# EAGLE design redox-light-left (EAGLE 9.1.3)
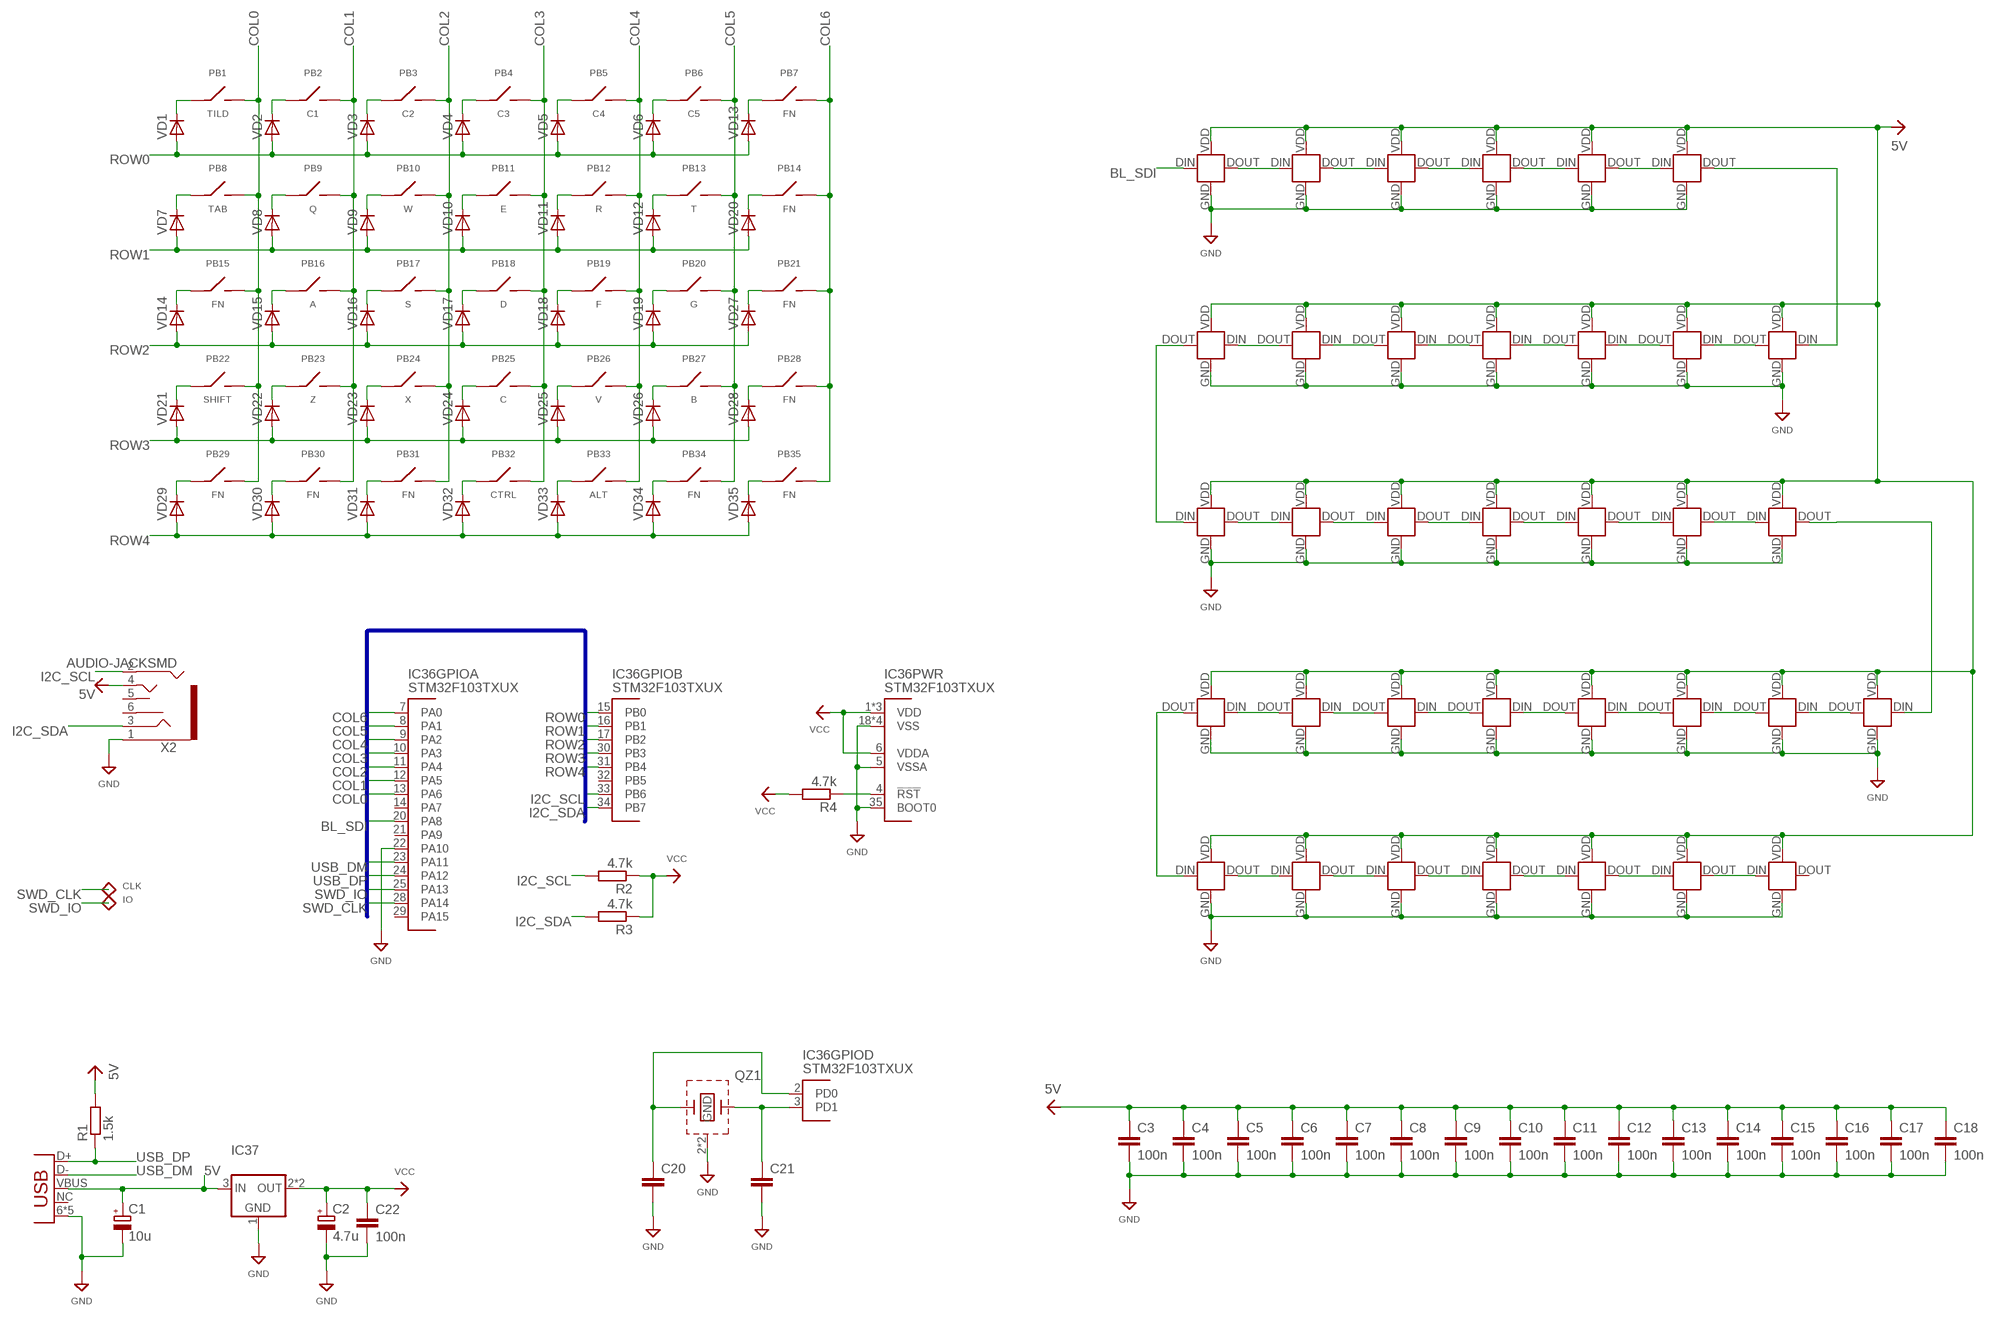
[diagram p0: schematic, sheet 1]

## Parts
C1  10u  CPOL-EUSMCA  [SMC_A]
C2  4.7u  CPOL-EUSMCA  [SMC_A]
C3  100n  CAP0402  [R0402]
C4  100n  CAP0402  [R0402]
C5  100n  CAP0402  [R0402]
C6  100n  CAP0402  [R0402]
C7  100n  CAP0402  [R0402]
C8  100n  CAP0402  [R0402]
C9  100n  CAP0402  [R0402]
C10  100n  CAP0402  [R0402]
C11  100n  CAP0402  [R0402]
C12  100n  CAP0402  [R0402]
C13  100n  CAP0402  [R0402]
C14  100n  CAP0402  [R0402]
C15  100n  CAP0402  [R0402]
C16  100n  CAP0402  [R0402]
C17  100n  CAP0402  [R0402]
C18  100n  CAP0402  [R0402]
C20  CAP0402  [R0402]
C21  CAP0402  [R0402]
C22  100n  CAP0402  [R0402]
IC1  SK68XX-MINI  [SK68XX-MINI]
IC2  SK68XX-MINI  [SK68XX-MINI]
IC3  SK68XX-MINI  [SK68XX-MINI]
IC4  SK68XX-MINI  [SK68XX-MINI]
IC5  SK68XX-MINI  [SK68XX-MINI]
IC6  SK68XX-MINI  [SK68XX-MINI]
IC7  SK68XX-MINI  [SK68XX-MINI]
IC8  SK68XX-MINI  [SK68XX-MINI]
IC9  SK68XX-MINI  [SK68XX-MINI]
IC10  SK68XX-MINI  [SK68XX-MINI]
IC11  SK68XX-MINI  [SK68XX-MINI]
IC12  SK68XX-MINI  [SK68XX-MINI]
IC13  SK68XX-MINI  [SK68XX-MINI]
IC14  SK68XX-MINI  [SK68XX-MINI]
IC15  SK68XX-MINI  [SK68XX-MINI]
IC16  SK68XX-MINI  [SK68XX-MINI]
IC17  SK68XX-MINI  [SK68XX-MINI]
IC18  SK68XX-MINI  [SK68XX-MINI]
IC19  SK68XX-MINI  [SK68XX-MINI]
IC20  SK68XX-MINI  [SK68XX-MINI]
IC21  SK68XX-MINI  [SK68XX-MINI]
IC22  SK68XX-MINI  [SK68XX-MINI]
IC23  SK68XX-MINI  [SK68XX-MINI]
IC24  SK68XX-MINI  [SK68XX-MINI]
IC25  SK68XX-MINI  [SK68XX-MINI]
IC26  SK68XX-MINI  [SK68XX-MINI]
IC27  SK68XX-MINI  [SK68XX-MINI]
IC28  SK68XX-MINI  [SK68XX-MINI]
IC29  SK68XX-MINI  [SK68XX-MINI]
IC30  SK68XX-MINI  [SK68XX-MINI]
IC31  SK68XX-MINI  [SK68XX-MINI]
IC32  SK68XX-MINI  [SK68XX-MINI]
IC33  SK68XX-MINI  [SK68XX-MINI]
IC34  SK68XX-MINI  [SK68XX-MINI]
IC35  SK68XX-MINI  [SK68XX-MINI]
IC36  STM32F103TXUX  [QFN-36]
IC37  LM1117  [SOT89]
PB1  TILD  CHERRY-MX-KAILH  [CHERRY-MX-KAILH]
PB2  C1  CHERRY-MX-KAILH  [CHERRY-MX-KAILH]
PB3  C2  CHERRY-MX-KAILH  [CHERRY-MX-KAILH]
PB4  C3  CHERRY-MX-KAILH  [CHERRY-MX-KAILH]
PB5  C4  CHERRY-MX-KAILH  [CHERRY-MX-KAILH]
PB6  C5  CHERRY-MX-KAILH  [CHERRY-MX-KAILH]
PB7  FN  CHERRY-MX-KAILH  [CHERRY-MX-KAILH]
PB8  TAB  CHERRY-MX-KAILH  [CHERRY-MX-KAILH]
PB9  Q  CHERRY-MX-KAILH  [CHERRY-MX-KAILH]
PB10  W  CHERRY-MX-KAILH  [CHERRY-MX-KAILH]
PB11  E  CHERRY-MX-KAILH  [CHERRY-MX-KAILH]
PB12  R  CHERRY-MX-KAILH  [CHERRY-MX-KAILH]
PB13  T  CHERRY-MX-KAILH  [CHERRY-MX-KAILH]
PB14  FN  CHERRY-MX-KAILH  [CHERRY-MX-KAILH]
PB15  FN  CHERRY-MX-KAILH  [CHERRY-MX-KAILH]
PB16  A  CHERRY-MX-KAILH  [CHERRY-MX-KAILH]
PB17  S  CHERRY-MX-KAILH  [CHERRY-MX-KAILH]
PB18  D  CHERRY-MX-KAILH  [CHERRY-MX-KAILH]
PB19  F  CHERRY-MX-KAILH  [CHERRY-MX-KAILH]
PB20  G  CHERRY-MX-KAILH  [CHERRY-MX-KAILH]
PB21  FN  CHERRY-MX-KAILH  [CHERRY-MX-KAILH]
PB22  SHIFT  CHERRY-MX-KAILH  [CHERRY-MX-KAILH]
PB23  Z  CHERRY-MX-KAILH  [CHERRY-MX-KAILH]
PB24  X  CHERRY-MX-KAILH  [CHERRY-MX-KAILH]
PB25  C  CHERRY-MX-KAILH  [CHERRY-MX-KAILH]
PB26  V  CHERRY-MX-KAILH  [CHERRY-MX-KAILH]
PB27  B  CHERRY-MX-KAILH  [CHERRY-MX-KAILH]
PB28  FN  CHERRY-MX-KAILH  [CHERRY-MX-KAILH]
PB29  FN  CHERRY-MX-KAILH  [CHERRY-MX-KAILH]
PB30  FN  CHERRY-MX-KAILH  [CHERRY-MX-KAILH]
PB31  FN  CHERRY-MX-KAILH  [CHERRY-MX-KAILH]
PB32  CTRL  CHERRY-MX-KAILH  [CHERRY-MX-KAILH]
PB33  ALT  CHERRY-MX-KAILH  [CHERRY-MX-KAILH]
PB34  FN  CHERRY-MX-KAILH  [CHERRY-MX-KAILH]
PB35  FN  CHERRY-MX-KAILH  [CHERRY-MX-KAILH]
QZ1  QUARTZ_GND3225  [3225]
R1  1.5k  RESR0402  [R0402]
R2  4.7k  RESR0402  [R0402]
R3  4.7k  RESR0402  [R0402]
R4  4.7k  RESR0402  [R0402]
TP1  CLK  TP10R  [TP10R]
TP2  IO  TP10R  [TP10R]
VD1  DIODE-SOD123  [SOD123]
VD2  DIODE-SOD123  [SOD123]
VD3  DIODE-SOD123  [SOD123]
VD4  DIODE-SOD123  [SOD123]
VD5  DIODE-SOD123  [SOD123]
VD6  DIODE-SOD123  [SOD123]
VD7  DIODE-SOD123  [SOD123]
VD8  DIODE-SOD123  [SOD123]
VD9  DIODE-SOD123  [SOD123]
VD10  DIODE-SOD123  [SOD123]
VD11  DIODE-SOD123  [SOD123]
VD12  DIODE-SOD123  [SOD123]
VD13  DIODE-SOD123  [SOD123]
VD14  DIODE-SOD123  [SOD123]
VD15  DIODE-SOD123  [SOD123]
VD16  DIODE-SOD123  [SOD123]
VD17  DIODE-SOD123  [SOD123]
VD18  DIODE-SOD123  [SOD123]
VD19  DIODE-SOD123  [SOD123]
VD20  DIODE-SOD123  [SOD123]
VD21  DIODE-SOD123  [SOD123]
VD22  DIODE-SOD123  [SOD123]
VD23  DIODE-SOD123  [SOD123]
VD24  DIODE-SOD123  [SOD123]
VD25  DIODE-SOD123  [SOD123]
VD26  DIODE-SOD123  [SOD123]
VD27  DIODE-SOD123  [SOD123]
VD28  DIODE-SOD123  [SOD123]
VD29  DIODE-SOD123  [SOD123]
VD30  DIODE-SOD123  [SOD123]
VD31  DIODE-SOD123  [SOD123]
VD32  DIODE-SOD123  [SOD123]
VD33  DIODE-SOD123  [SOD123]
VD34  DIODE-SOD123  [SOD123]
VD35  DIODE-SOD123  [SOD123]
X1  USBMICRO_B  [USB_MICROB]
X2  AUDIO-JACKSMD  [PJ-342]

## Nets
5V: C1.+ C3.1 C4.1 C5.1 C6.1 C7.1 C8.1 C9.1 C10.1 C11.1 C12.1 C13.1 C14.1 C15.1 C16.1 C17.1 C18.1 IC1.VDD(VCC) IC2.VDD(VCC) IC3.VDD(VCC) IC4.VDD(VCC) IC5.VDD(VCC) IC6.VDD(VCC) IC7.VDD(VCC) IC8.VDD(VCC) IC9.VDD(VCC) IC10.VDD(VCC) IC11.VDD(VCC) IC12.VDD(VCC) IC13.VDD(VCC) IC14.VDD(VCC) IC15.VDD(VCC) IC16.VDD(VCC) IC17.VDD(VCC) IC18.VDD(VCC) IC19.VDD(VCC) IC20.VDD(VCC) IC21.VDD(VCC) IC22.VDD(VCC) IC23.VDD(VCC) IC24.VDD(VCC) IC25.VDD(VCC) IC26.VDD(VCC) IC27.VDD(VCC) IC28.VDD(VCC) IC29.VDD(VCC) IC30.VDD(VCC) IC31.VDD(VCC) IC32.VDD(VCC) IC33.VDD(VCC) IC34.VDD(VCC) IC35.VDD(VCC) IC37.3(IN) R1.2 X1.VBUS X2.4
BL_SDI: IC1.DIN IC36.20(GPIOA:PA8)
COL0 [KEYS-MATRIX]: IC36.13(GPIOA:PA6) PB1.2 PB8.2 PB15.2 PB22.2 PB29.2
COL1 [KEYS-MATRIX]: IC36.12(GPIOA:PA5) PB2.2 PB9.2 PB16.2 PB23.2 PB30.2
COL2 [KEYS-MATRIX]: IC36.11(GPIOA:PA4) PB3.2 PB10.2 PB17.2 PB24.2 PB31.2
COL3 [KEYS-MATRIX]: IC36.10(GPIOA:PA3) PB4.2 PB11.2 PB18.2 PB25.2 PB32.2
COL4 [KEYS-MATRIX]: IC36.9(GPIOA:PA2) PB5.2 PB12.2 PB19.2 PB26.2 PB33.2
COL5 [KEYS-MATRIX]: IC36.8(GPIOA:PA1) PB6.2 PB13.2 PB20.2 PB27.2 PB34.2
COL6 [KEYS-MATRIX]: IC36.7(GPIOA:PA0) PB7.2 PB14.2 PB21.2 PB28.2 PB35.2
GND: C1.- C2.- C3.2 C4.2 C5.2 C6.2 C7.2 C8.2 C9.2 C10.2 C11.2 C12.2 C13.2 C14.2 C15.2 C16.2 C17.2 C18.2 C20.2 C21.2 C22.2 IC1.GND IC2.GND IC3.GND IC4.GND IC5.GND IC6.GND IC7.GND IC8.GND IC9.GND IC10.GND IC11.GND IC12.GND IC13.GND IC14.GND IC15.GND IC16.GND IC17.GND IC18.GND IC19.GND IC20.GND IC21.GND IC22.GND IC23.GND IC24.GND IC25.GND IC26.GND IC27.GND IC28.GND IC29.GND IC30.GND IC31.GND IC32.GND IC33.GND IC34.GND IC35.GND IC36.5(PWR:VSSA) IC36.18(PWR:VSS) IC36.22(GPIOA:PA10) IC36.26(PWR:VSS) IC36.35(PWR:BOOT0) IC36.36(PWR:VSS) IC36.PGND(PWR:VSS) IC37.1(GND) QZ1.2(GND) QZ1.4(GND) X1.6(GND) X1.7(GND) X1.8(GND) X1.9(GND) X1.GND X2.1
I2C_SCL: IC36.33(GPIOB:PB6) R2.2 X2.2
I2C_SDA: IC36.34(GPIOB:PB7) R3.2 X2.3
N$1: IC1.DOUT IC2.DIN
N$2: IC2.DOUT IC3.DIN
N$3: IC3.DOUT IC4.DIN
N$4: IC4.DOUT IC5.DIN
N$5: IC5.DOUT IC6.DIN
N$6: IC7.DOUT IC8.DIN
N$7: PB1.1 VD1.C
N$8: IC21.DOUT IC22.DIN
N$9: IC22.DOUT IC23.DIN
N$10: IC23.DOUT IC24.DIN
N$11: IC24.DOUT IC25.DIN
N$12: IC25.DOUT IC26.DIN
N$13: IC8.DOUT IC9.DIN
N$14: IC13.DOUT IC14.DIN
N$15: IC26.DOUT IC27.DIN
N$16: IC20.DOUT IC21.DIN
N$17: PB4.1 VD4.C
N$18: PB3.1 VD3.C
N$19: PB5.1 VD5.C
N$20: PB6.1 VD6.C
N$21: PB2.1 VD2.C
N$22: PB7.1 VD13.C
N$23: C20.1 IC36.2(GPIOD:PD0) QZ1.3
N$24: PB8.1 VD7.C
N$25: PB9.1 VD8.C
N$26: PB10.1 VD9.C
N$27: PB11.1 VD10.C
N$28: PB12.1 VD11.C
N$29: PB13.1 VD12.C
N$30: PB14.1 VD20.C
N$31: C21.1 IC36.3(GPIOD:PD1) QZ1.1
N$32: IC9.DOUT IC10.DIN
N$33: IC10.DOUT IC11.DIN
N$34: IC11.DOUT IC12.DIN
N$35: IC36.4(PWR:!RST) R4.1
N$36: IC12.DOUT IC13.DIN
N$37: IC6.DOUT IC7.DIN
N$38: IC14.DOUT IC15.DIN
N$39: IC15.DOUT IC16.DIN
N$40: IC16.DOUT IC17.DIN
N$41: IC17.DOUT IC18.DIN
N$42: IC18.DOUT IC19.DIN
N$44: IC19.DOUT IC20.DIN
N$46: PB15.1 VD14.C
N$47: PB16.1 VD15.C
N$48: PB17.1 VD16.C
N$49: PB18.1 VD17.C
N$50: PB19.1 VD18.C
N$51: PB20.1 VD19.C
N$52: IC27.DOUT IC28.DIN
N$53: IC29.DOUT IC30.DIN
N$54: PB22.1 VD21.C
N$55: PB23.1 VD22.C
N$56: PB29.1 VD29.C
N$57: PB30.1 VD30.C
N$58: PB24.1 VD23.C
N$59: PB25.1 VD24.C
N$60: PB26.1 VD25.C
N$61: PB27.1 VD26.C
N$62: PB21.1 VD27.C
N$63: PB28.1 VD28.C
N$64: PB31.1 VD31.C
N$65: PB32.1 VD32.C
N$66: PB33.1 VD33.C
N$67: PB34.1 VD34.C
N$68: PB35.1 VD35.C
N$69: IC30.DOUT IC31.DIN
N$70: IC31.DOUT IC32.DIN
N$71: IC32.DOUT IC33.DIN
N$72: IC33.DOUT IC34.DIN
N$74: IC34.DOUT IC35.DIN
N$75: IC28.DOUT IC29.DIN
ROW0 [KEYS-MATRIX]: IC36.15(GPIOB:PB0) VD1.A VD2.A VD3.A VD4.A VD5.A VD6.A VD13.A
ROW1 [KEYS-MATRIX]: IC36.16(GPIOB:PB1) VD7.A VD8.A VD9.A VD10.A VD11.A VD12.A VD20.A
ROW2 [KEYS-MATRIX]: IC36.17(GPIOB:PB2) VD14.A VD15.A VD16.A VD17.A VD18.A VD19.A VD27.A
ROW3 [KEYS-MATRIX]: IC36.30(GPIOB:PB3) VD21.A VD22.A VD23.A VD24.A VD25.A VD26.A VD28.A
ROW4 [KEYS-MATRIX]: IC36.31(GPIOB:PB4) VD29.A VD30.A VD31.A VD32.A VD33.A VD34.A VD35.A
SWD_CLK: IC36.28(GPIOA:PA14) TP1.TP(TEST)
SWD_IO: IC36.25(GPIOA:PA13) TP2.TP(TEST)
USB_DM: IC36.23(GPIOA:PA11) X1.D-
USB_DP: IC36.24(GPIOA:PA12) R1.1 X1.D+
VCC: C2.+ C22.1 IC36.1(PWR:VDD) IC36.6(PWR:VDDA) IC36.19(PWR:VDD) IC36.27(PWR:VDD) IC37.2(OUT) IC37.4(OUT) R2.1 R3.1 R4.2
Unconnected: IC35.DOUT IC36.14(GPIOA:PA7) IC36.21(GPIOA:PA9) IC36.29(GPIOA:PA15) IC36.32(GPIOB:PB5) X1.NC X2.5 X2.6

## Buses
BL_SDI,COL[0..7],FLASH_CS,I2C_SCL,I2C_SDA,ROW[0..4],SPI_MISO,SPI_MOSI,SPI_SCL,SR_CLK,SR_CLR,SR_D,SWD_CLK,SWD_IO,UART_RX,UART_TX,USB_DM,USB_DP

## Library data of the parts
C1 C2 = netcat:CPOL-EU
C3-C18 C20-C22 = netcat:CAP
IC1-IC6 IC14-IC35 = keyb:SK68XX
IC7-IC13 = keyb:SK68XX; SPICEPREFIX: E
IC36 = netcat:STM32F103
IC37 = netcat:LM1117
PB1-PB35 = keyb:CHERRY-MX
QZ1 = netcat:QUARTZ_GND
R1-R4 = netcat:RES
TP1 TP2 = netcat:TP
VD1-VD35 = netcat:DIODE
X1 = netcat:USB: USB Connectors USB-B-PTH is fully proven SKU : PRT-00139 USB-miniB is fully proven SKU : PRT-00587 USB-A-PCB is untested. USB-A-H is throughly reviewed, but untested. Spark Fun Electronics SKU : PRT-00437 USB-B-SMT is throughly reviewed, but untested. Needs silkscreen touching up. USB-A-S has not been used/tested USB-MB-H has not been used/tested
X2 = netcat:AUDIO-JACK

## Board
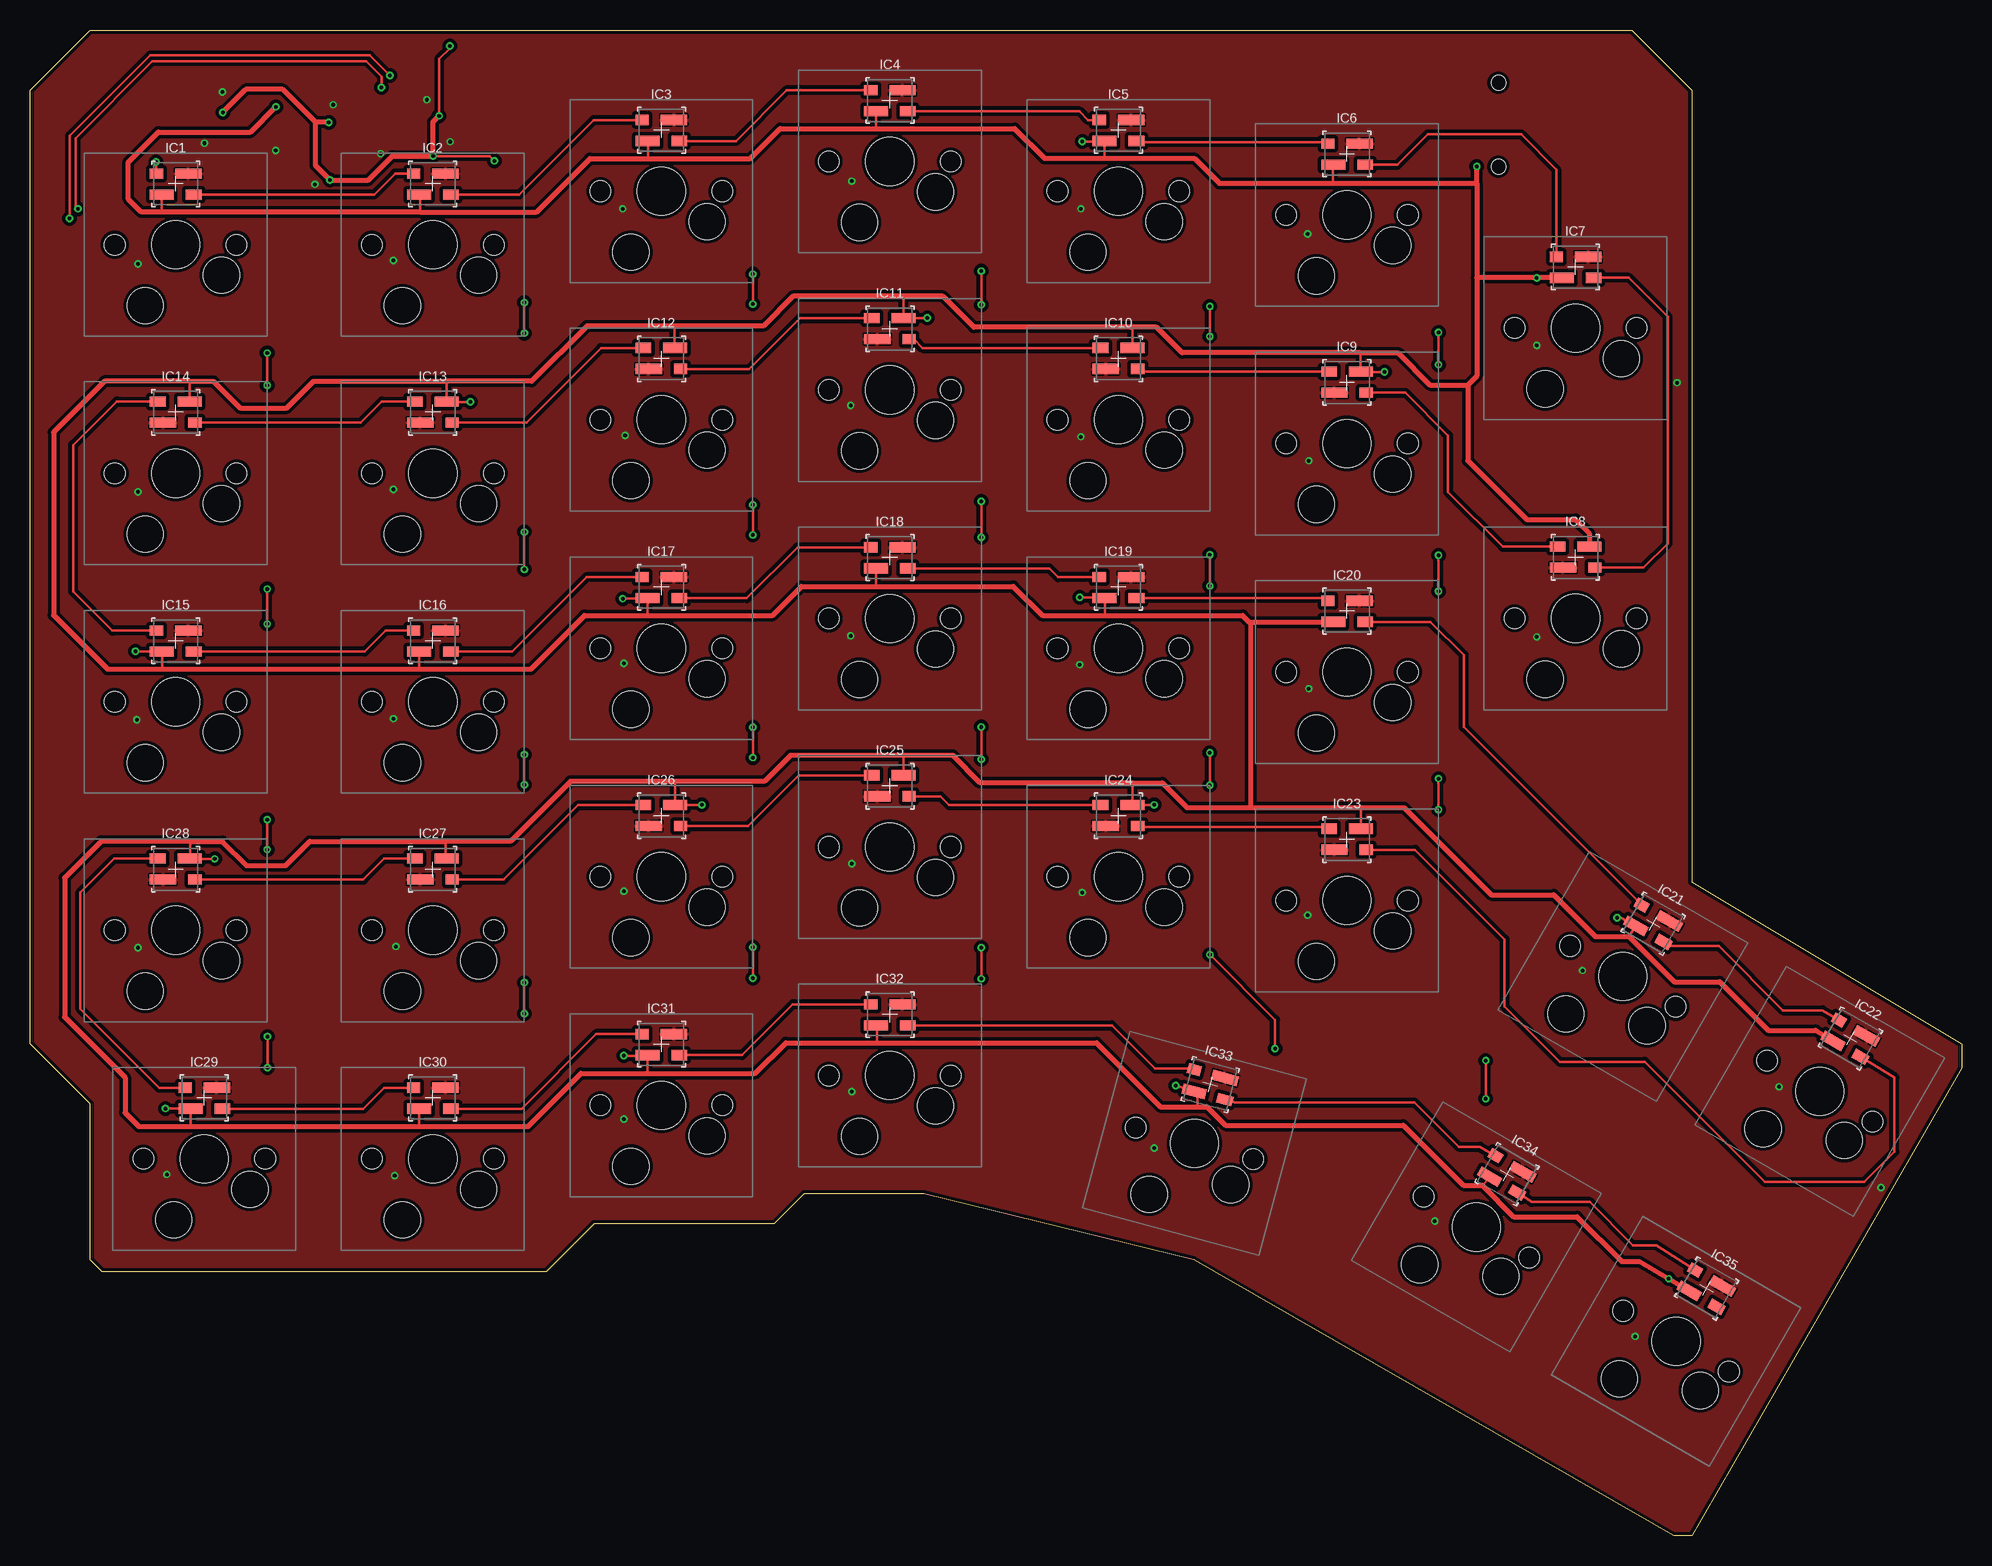
[diagram p1: board, top side]
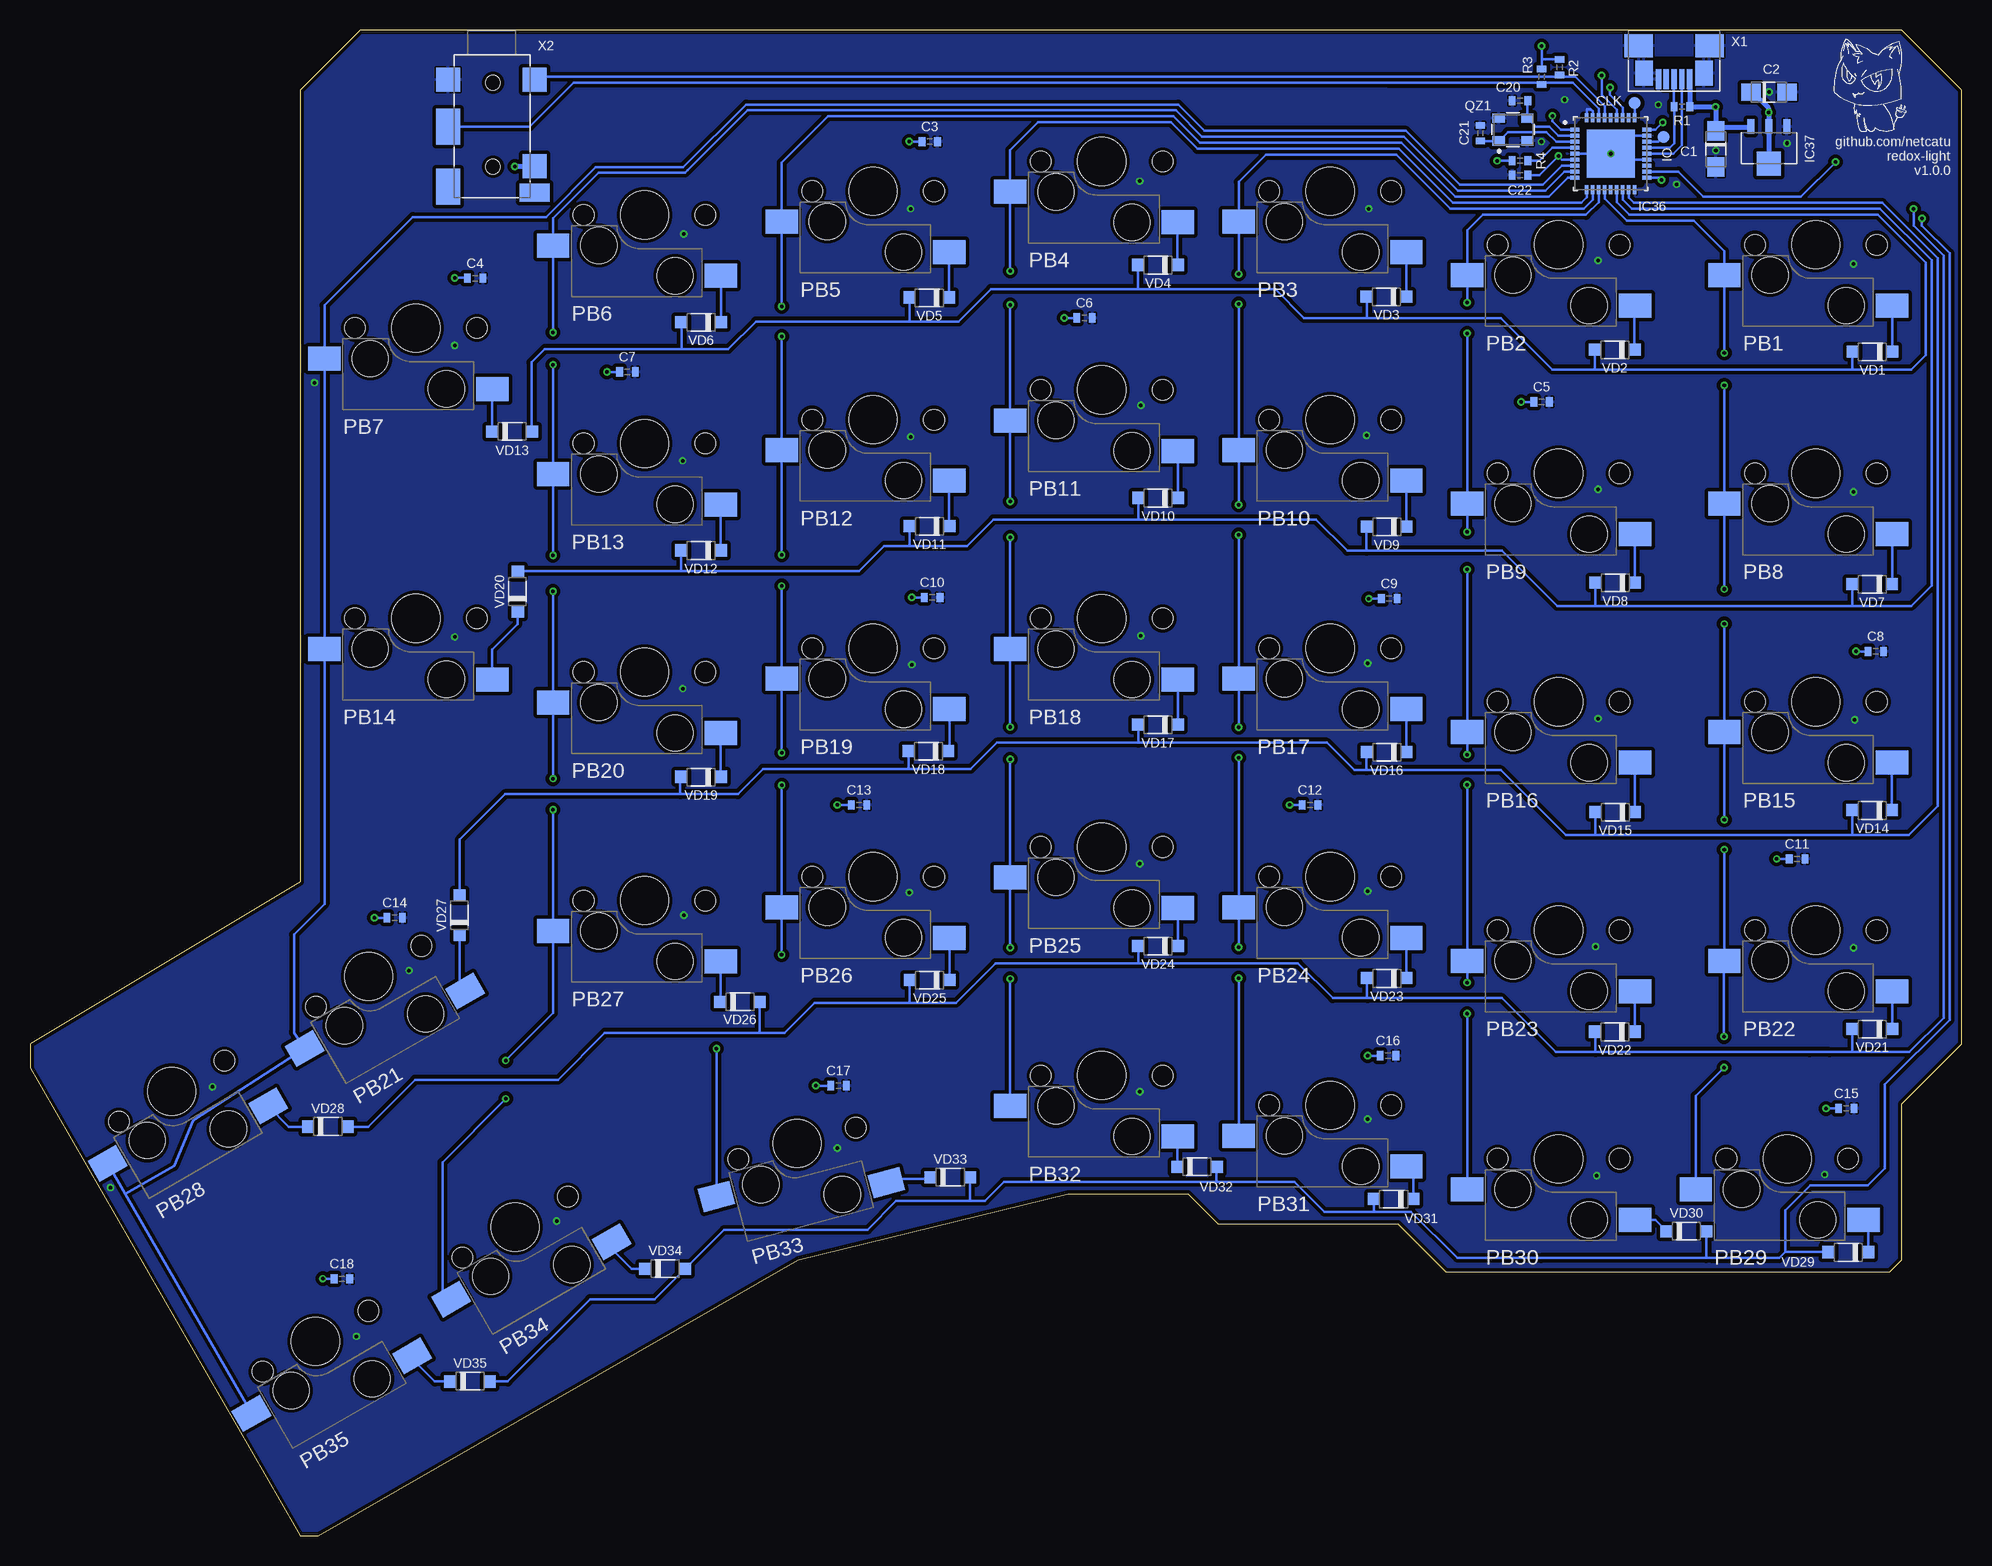
[diagram p2: board, bottom side, seen from below]

Size 161 x 125.5 mm. Coordinates in mm from the lower left corner, seen from the top.
Outline: 0,120.5 5,125.5 133.5,125.5 138.5,120.5 138.5,54.5 161,41 161,39 138.5,0 137,0 97,23 74.5,28.5 64.5,28.5 62,26 47,26 43,22 6,22 5,23 5,36 0,41 0,120.5
Copper layers (1+16): Top 0.035mm / dielectric 0.2mm / Bottom 0.035mm
Design rules "mini-spartan6-plus *": minimum track width 6mil, minimum drill 6mil, track to track 6mil, track to pad 6mil, pad to pad 6mil, via to via 6mil, smd to smd 0mil, copper to edge 6mil, drill to drill 6mil, minimum pad ring 10mil, minimum via ring 6mil, stop-mask expansion 2mil, vias tented up to drill 100mil, thermal gap 6mil
bRestrict: area 31.4,112.7 to 31.8,114.9; area 31.4,115.5 to 31.8,117.7; area 26.8,117.3 to 31.4,117.7; area 26.8,117 to 27.1,117.3; area 31,118 to 31,118.4; area 31.5,118 to 31.5,118.4; area 26.8,112.7 to 27.1,114.5; area 26.8,115 to 27.1,116.5; area 27.1,112.7 to 31.4,113

### Footprints (pad centres in the part's own frame; a part is rotated, then mirrored left to right if it is on the bottom)
SMC_A = smd 1.6 x 1.4: + -1.5,0; - 1.5,0
R0402 = smd 0.559 x 0.762: 1 -0.65,0; 2 0.65,0
SK68XX-MINI = smd 1.1 x 0.85: DIN 1.6,-0.85 | smd 1.3 x 0.85: DOUT -1.5,0.9 | smd 2.2 x 0.85: GND -1.05,-0.85 | smd 2 x 0.85: VDD 1.15,0.9
QFN-36 = smd 0.75 x 0.3: 1 -3,2; 2 -3,1.5; 3 -3,1; 4 -3,0.5; 5 -3,0; 6 -3,-0.5; 7 -3,-1; 8 -3,-1.5; 9 -3,-2; 19 3,-2; 20 3,-1.5; 21 3,-1; 22 3,-0.5; 23 3,0; 24 3,0.5; 25 3,1; 26 3,1.5; 27 3,2 | smd 0.3 x 0.75: 10 -2,-3; 11 -1.5,-3; 12 -1,-3; 13 -0.5,-3; 14 0,-3; 15 0.5,-3; 16 1,-3; 17 1.5,-3; 18 2,-3; 28 2,3; 29 1.5,3; 30 1,3; 31 0.5,3; 32 0,3; 33 -0.5,3; 34 -1,3; 35 -1.5,3; 36 -2,3 | smd 4 x 4: PGND 0,0
SOT89 = smd 0.58 x 1.2: 1 -1.5,-1.8; 2 0,-1.8; 3 1.5,-1.8 | smd 2 x 2: 4 0,1.3
CHERRY-MX-KAILH = smd 2.7 x 2 bottom: 1 -6.355,-5.08; 2 7.625,-2.54 | hole 4: 0,0 | hole 1.7: -5.08,0; 5.08,0 | hole 3: 3.81,-2.54; -2.54,-5.08
3225 = smd 1.016 x 0.762: 1 -1.28,-0.948; 2 1.121,-0.948; 3 1.121,0.948; 4 -1.28,0.948
TP10R = smd 1 x 1: TP 0,0
SOD123 = smd 1.016 x 1.016: A 1.646,-0.025; C -1.646,-0.025
USB_MICROB = smd 2.1 x 1.475: 6 2.3,-2.5; 8 2.3,2.5 | smd 1.9 x 2.375: 7 0,-2.95; 9 0,2.95 | smd 1.7 x 0.45: D+ 2.8,0; D- 2.8,0.65; GND 2.8,-1.3; NC 2.8,-0.65; VBUS 2.8,1.3
PJ-342 = smd 2 x 2: 1 -3.44,-3.73; 2 -3.44,3.47; 4 3.76,3.47 | smd 3 x 2: 3 0.46,-3.73; 6 5.46,-3.73 | smd 1.5 x 2.5: 5 5.96,3.47 | hole 1.2: 3.8,0; -3.2,0

### Placement (x,y rotation side)
C1  20.48,115.58 270 bottom
C2  16.05,120.33 0 bottom
C3  86,116.2 0 bottom
C4  123.9,104.8 0 bottom
C5  35,94.5 0 bottom
C6  73.1,101.5 0 bottom
C7  111.2,97 0 bottom
C8  7.15,73.7 0 bottom
C9  47.7,78.1 0 bottom
C10  85.8,78.2 0 bottom
C11  13.7,56.4 0 bottom
C12  54.3,60.9 0 bottom
C13  91.9,60.9 0 bottom
C14  130.6,51.5 0 bottom
C15  9.6,35.6 0 bottom
C16  47.8,40 0 bottom
C17  93.6,37.5 0 bottom
C18  135,21.4 0 bottom
C20  36.8,119.6 180 bottom
C21  40.1,116.9 90 bottom
C22  36.8,113.4 180 bottom
IC1  12.14,112.68 180 top
IC2  33.58,112.68 180 top
IC3  52.62,117.14 180 top
IC4  71.67,119.62 180 top
IC5  90.72,117.14 180 top
IC6  109.78,115.16 180 top
IC7  128.82,105.74 180 top
IC8  128.82,81.53 0 top
IC9  109.78,96.11 0 top
IC10  90.72,98.09 0 top
IC11  71.67,100.57 0 top
IC12  52.62,98.09 0 top
IC13  33.58,93.63 0 top
IC14  12.14,93.63 0 top
IC15  12.14,74.58 180 top
IC16  33.58,74.58 180 top
IC17  52.62,79.04 180 top
IC18  71.67,81.52 180 top
IC19  90.72,79.04 180 top
IC20  109.78,77.06 180 top
IC21  135.3,51.01 150 top
IC22  151.74,41.43 150 top
IC23  109.78,58.01 0 top
IC24  90.72,59.99 0 top
IC25  71.67,62.47 0 top
IC26  52.62,59.99 0 top
IC27  33.58,55.53 0 top
IC28  12.14,55.53 0 top
IC29  14.53,36.48 180 top
IC30  33.58,36.48 180 top
IC31  52.62,40.94 180 top
IC32  71.67,43.42 180 top
IC33  98.38,37.59 165 top
IC34  123.11,30.12 150 top
IC35  139.75,20.59 150 top
IC36  29.23,115.19 0 bottom
IC37  16.05,115.65 180 bottom
PB1  12.14,107.6 0 top
PB2  33.58,107.6 0 top
PB3  52.62,112.06 0 top
PB4  71.67,114.54 0 top
PB5  90.72,112.06 0 top
PB6  109.78,110.08 0 top
PB7  128.82,100.66 0 top
PB8  12.14,88.55 0 top
PB9  33.58,88.55 0 top
PB10  52.62,93.01 0 top
PB11  71.67,95.49 0 top
PB12  90.72,93.01 0 top
PB13  109.78,91.03 0 top
PB14  128.82,76.45 0 top
PB15  12.14,69.5 0 top
PB16  33.58,69.5 0 top
PB17  52.62,73.96 0 top
PB18  71.67,76.44 0 top
PB19  90.72,73.96 0 top
PB20  109.78,71.98 0 top
PB21  132.76,46.61 330 top
PB22  12.14,50.45 0 top
PB23  33.58,50.45 0 top
PB24  52.62,54.91 0 top
PB25  71.67,57.39 0 top
PB26  90.72,54.91 0 top
PB27  109.78,52.93 0 top
PB28  149.2,37.03 330 top
PB29  14.53,31.4 0 top
PB30  33.58,31.4 0 top
PB31  52.62,35.86 0 top
PB32  71.67,38.34 0 top
PB33  97.07,32.69 345 top
PB34  120.57,25.72 330 top
PB35  137.21,16.19 330 top
QZ1  37.3,117.2 0 bottom
R1  23.3,119.1 0 bottom
R2  33.5,122.4 270 bottom
R3  35,121.6 270 bottom
R4  36.8,114.6 180 bottom
TP1  27.25,119.4 270 bottom
TP2  24.85,116.6 270 bottom
U$1  [LOGO2]  7.6,120.9 0 bottom
VD1  7.42,98.66 180 bottom
VD2  28.9,98.83 180 bottom
VD3  47.93,103.25 180 bottom
VD4  66.98,105.9 180 bottom
VD5  86.04,103.18 180 bottom
VD6  105.06,101.13 180 bottom
VD7  7.45,79.28 180 bottom
VD8  28.86,79.4 180 bottom
VD9  47.91,84.08 180 bottom
VD10  66.96,86.48 180 bottom
VD11  86.03,84.13 180 bottom
VD12  105.07,82.1 180 bottom
VD13  120.81,92.05 0 bottom
VD14  7.45,60.44 180 bottom
VD15  28.87,60.28 180 bottom
VD16  47.91,65.28 180 bottom
VD17  66.97,67.57 180 bottom
VD18  86.11,65.37 180 bottom
VD19  105.07,63.22 180 bottom
VD20  120.36,78.69 90 bottom
VD21  7.44,42.2 180 bottom
VD22  28.89,41.98 180 bottom
VD23  47.91,46.44 180 bottom
VD24  66.98,49.13 180 bottom
VD25  86.01,46.29 180 bottom
VD26  101.82,44.51 0 bottom
VD27  125.2,51.71 90 bottom
VD28  136.17,34.1 0 bottom
VD29  9.43,23.6 180 bottom
VD30  22.93,25.38 0 bottom
VD31  47.33,28.03 180 bottom
VD32  63.72,30.76 0 bottom
VD33  84.29,29.87 0 bottom
VD34  108.05,22.25 0 bottom
VD35  124.32,12.86 0 bottom
X1  23.96,124.2 270 bottom
X2  122.4,117.9 270 bottom

### Tracks (layer width: path | path; a pad name or v marks a point on that pad's centre or on a via)
5V  (via drill 0.3)
  Top 0.2: IC32.VDD 70.6,42.45 70.6,41.08 | IC3.VDD 51.5,116.22 51.5,114.78 | IC5.VDD 89.58,114.83 89.6,114.8 | IC6.VDD 108.6,114.24 108.6,112.72 | IC1.VDD 10.99,110.33 11,110.33 | IC2.VDD 32.5,111.78 32.5,110.33 | IC9.VDD 110.9,97.01 110.9,98.6 | IC15.VDD 11,72.22 | IC16.VDD 32.42,72.22 32.4,72.22 | IC31.VDD 51.48,38.52 51.4,38.52 | IC19.VDD 89.6,78.14 89.6,76.7 | IC18.VDD 70.5,80.62 70.5,79.12 | IC17.VDD 51.48,76.7 51.5,76.7 | IC21.VDD 133.28,49.92
  Top 0.203: 121.05,29.19 121.66,29.81 IC34.VDD | IC30.VDD 32.42,34.1 | 13.35,34.1 13.38,34.1 IC29.VDD 13.36,35.6 v11.3,35.6 | IC28.VDD 13.35,56.43 13.35,56.5 | 13.35,56.5 13.35,57.88 | IC27.VDD 34.65,56.43 34.65,57.88 | IC26.VDD 53.77,62.88 53.75,62.88 | IC25.VDD 72.83,65.03 72.78,65.03 | IC24.VDD 91.88,62.75 91.85,62.75 | IC23.VDD 110.92,60.67 | IC19.VDD 89.62,78.14 89.62,78.44 89.38,78.2 v87.5,78.2 | IC15.VDD 10.95,73.68 10.93,73.7 v8.8,73.7 | IC14.VDD 13.29,96.22 13.28,96.22 | 34.77,96.22 34.73,96.22 IC13.VDD 34.75,94.5 v36.7,94.5 | IC12.VDD 53.73,98.99 53.73,100.83 | 72.83,101.5 72.83,103.3 | IC10.VDD 91.88,100.72 91.7,100.72 | IC4.VDD 70.53,117.28 | IC5.VDD 89.6,116.24 89.6,116.54 89.26,116.2 v87.7,116.2 | v74.8,101.5 72.83,101.5 | v112.9,97 IC9.VDD | v49.4,78.1 51.43,78.1 IC17.VDD | v15.4,56.4 13.45,56.4 13.35,56.5 | v56,60.9 IC26.VDD | v93.7,60.9 IC24.VDD | IC21.VDD 132.65,51.5 v132.3,51.5 | v49.5,40 51.43,40 IC31.VDD | 97.3,35.75 97.3,37.02 IC33.VDD v95.51,37.5 v95.5,37.5 | IC11.VDD 72.83,101.5 | IC26.VDD | IC24.VDD
  Top 0.406: 120.6,112.72 108.6,112.72 99.12,112.72 97.05,114.8 89.6,114.8 84.55,114.8 82.08,117.28 70.53,117.28 62.52,117.28 60.02,114.78 51.5,114.78 46.67,114.78 42.23,110.33 32.5,110.33 11,110.33 9.28,110.33 8.2,111.4 8.2,114.5 10.7,117 18.39,117 v20.49,119.1 | 119.85,95.9 119.85,89.6 124.75,84.7 128.82,84.7 129.97,83.54 IC8.VDD | IC7.VDD v125.6,104.84 120.6,104.84 | 34.77,96.22 41.83,96.22 46.42,100.83 53.73,100.83 61.12,100.83 63.6,103.3 72.83,103.3 76.1,103.3 78.67,100.72 91.7,100.72 93.9,100.72 96.03,98.6 110.9,98.6 114,98.6 116.7,95.9 119.85,95.9 | 101.61,76.16 101.71,76.06 101.71,60.71 101.75,60.67 | 101.61,76.16 IC20.VDD | IC22.VDD 148.85,42.11 144.89,42.11 140.85,46.15 137.05,46.15 133.28,49.92 130.48,49.92 127,53.4 121.8,53.4 114.53,60.67 110.92,60.67 101.75,60.67 | 91.85,62.75 79.2,62.75 76.92,65.03 72.78,65.03 63.38,65.03 61.23,62.88 53.75,62.88 45.05,62.88 40.05,57.88 34.65,57.88 23.32,57.88 21.3,55.85 18.05,55.85 16.02,57.88 13.35,57.88 5.92,57.88 2.88,54.83 2.88,43.23 7.92,38.17 7.92,35.25 9.07,34.1 13.35,34.1 32.42,34.1 41.5,34.1 45.92,38.52 51.4,38.52 60.45,38.52 63,41.08 70.6,41.08 88.9,41.08 94.22,35.75 97.3,35.75 98.1,35.75 99.65,34.2 114.47,34.2 119.48,29.19 121.05,29.19 123.66,26.57 128.95,26.57 132.68,22.85 134.14,22.85 v136.6,21.4 IC35.VDD | 91.88,62.75 94.38,62.75 96.45,60.67 101.75,60.67 | 34.73,96.22 23.62,96.22 21.4,94 17.5,94 15.28,96.22 13.28,96.22 6.22,96.22 1.98,91.97 1.98,76.72 6.47,72.22 11,72.22 32.4,72.22 41.75,72.22 46.23,76.7 51.5,76.7 61.88,76.7 64.3,79.12 70.5,79.12 81.95,79.12 84.38,76.7 89.6,76.7 101.08,76.7 101.61,76.16
  Top 0.406: 120.6,104.84 120.6,96.65 119.85,95.9 | 120.6,112.72 120.6,104.84 | 120.6,112.72 v120.6,114.12
  Bottom 0.2: v125.6,104.84 124.55,104.84 C4.1 | C18.1 v136.6,21.4
  Bottom 0.203: C3.1 v87.7,116.2 | C5.1 v36.7,94.5 | C6.1 v74.8,101.5 | C7.1 v112.9,97 | C8.1 v8.8,73.7 | C9.1 v49.4,78.1 | C10.1 v87.5,78.2 | C11.1 v15.4,56.4 | C12.1 v56,60.9 | C13.1 v93.7,60.9 | C14.1 v132.3,51.5 | C15.1 v11.3,35.6 | C16.1 v49.5,40 | C17.1 v95.5,37.5
  Bottom 0.406: X1.VBUS 22.66,119.11 R1.2 v20.49,119.1 20.49,117.09 C1.+ 20.48,117.4 17.6,117.4 IC37.3 | X2.4 120.58,114.14 v120.6,114.12
BL_SDI  (via drill 0.3)
  Top 0.203: v10.5,114.5 10.5,113.57 IC1.DIN
  Bottom 0.203: IC36.20 23.6,113.69 21.51,111.6 13.4,111.6 v10.5,114.5
COL0  (via drill 0.3)
  Top 0.203: v19.8,39 v19.8,41.6 | v19.77,75.99 v19.77,78.89 | v19.77,57.18 v19.77,59.67 | v19.77,95.87 v19.77,98.57
  Bottom 0.2: 19.77,104.9 19.77,107.07 22.3,109.6 27.9,109.6 29.73,111.44
  Bottom 0.203: PB29.2 22.15,36.65 v19.8,39 | v19.8,41.6 19.8,47.88 PB22.2 v19.77,57.18 | v19.77,75.99 PB15.2 v19.77,59.67 | v19.77,78.89 PB8.2 v19.77,95.87 | v19.77,98.57 19.77,104.9 PB1.2 | 29.73,111.44 IC36.13
COL1  (via drill 0.3)
  Top 0.203: v41.2,43.5 v41.2,46.1 | v41.2,62.58 v41.2,65.1 | v41.2,80.53 v41.2,83.65 | v41.2,100.22 v41.2,102.78
  Bottom 0.203: PB30.2 v41.2,43.5 | v41.2,46.1 PB23.2 v41.2,62.58 | v41.2,65.1 PB16.2 v41.2,80.53 | v41.2,83.65 PB9.2 v41.2,100.22 | v41.2,102.78 PB2.2 41.2,108.8 39.9,110.1 31.3,110.1 30.23,111.17 IC36.12
COL2  (via drill 0.3)
  Top 0.203: v60.25,49.05 v60.25,46.45 | v60.25,64.85 v60.25,67.38 | v60.25,83.4 v60.25,85.92 | v60.25,102.65 v60.25,105.15
  Bottom 0.203: v60.25,49.05 PB24.2 v60.25,64.85 | v60.25,46.45 PB31.2 | v60.25,67.38 PB17.2 v60.25,83.4 | v60.25,85.92 PB10.2 v60.25,102.65 | v60.25,105.15 PB3.2 60.25,112.85 58,115.1 47.1,115.1 42.6,110.6 34.2,110.6 31.5,110.6 30.73,111.36 IC36.11
COL3  (via drill 0.3)
  Top 0.203: v79.3,46.4 v79.3,49 | v79.3,64.7 v79.3,67.4 | v79.3,83.2 v79.3,86.2 | v79.3,102.6 v79.3,105.4
  Bottom 0.203: PB32.2 v79.3,46.4 | v79.3,49 PB25.2 v79.3,64.7 | v79.3,67.4 PB18.2 v79.3,83.2 | v79.3,86.2 PB11.2 v79.3,102.6 | v79.3,105.4 PB4.2 79.3,115.5 77,117.8 65.9,117.8 63.7,115.6 46.9,115.6 42.4,111.1 31.7,111.1 31.23,111.56 IC36.10
COL4  (via drill 0.3)
  Top 0.203: v103.78,40.58 103.78,43 v98.35,48.42 | v98.35,62.55 v98.35,65.25 | v98.35,99.95 v98.35,102.45 | v98.35,79.15 v98.35,81.75
  Bottom 0.203: PB33.2 v103.77,40.57 v103.78,40.58 | v98.35,48.42 PB26.2 v98.35,62.55 | v98.35,65.25 PB19.2 v98.35,79.15 | v98.35,99.95 PB12.2 v98.35,81.75 | v98.35,102.45 PB5.2 98.35,114.45 94.5,118.3 65.7,118.3 63.5,116.1 46.7,116.1 42.2,111.6 34.4,111.6 32.81,113.19 IC36.9
COL5  (via drill 0.3)
  Top 0.203: v121.35,36.4 v121.35,39.6 | v117.4,78.7 v117.4,81.7 | v117.4,60.5 v117.4,63.1 | v117.4,97.6 v117.4,100.3
  Bottom 0.2: 106.2,113.8 106.4,113.6 113.6,113.6 117.4,109.8 PB6.2
  Bottom 0.203: PB34.2 126.62,20.43 126.62,31.12 v121.35,36.4 | v121.35,39.6 117.4,43.55 PB27.2 v117.4,60.5 | v117.4,78.7 PB20.2 v117.4,63.1 | v117.4,81.7 PB13.2 v117.4,97.6 | v117.4,100.3 PB6.2 | 106.2,113.8 101.2,118.8 65.5,118.8 63.3,116.6 46.5,116.6 42,112.1 34.7,112.1 33.11,113.69 IC36.8
COL6
  Bottom 0.2: PB35.2 153.06,28.47 | 153.06,28.47 PB28.2 | 149,30.8 153.06,28.47 | 106.55,114.05 113.85,114.05 118,109.9 129.1,109.9
  Bottom 0.203: 106.55,114.05 101.31,119.29 65.29,119.29 63.1,117.1 46.3,117.1 41.8,112.6 34.9,112.6 33.31,114.19 IC36.7 | 129.1,109.9 136.45,102.55 PB7.2 PB14.2 136.45,52.65 139,50.1 139,42 138.99,41.98 138.99,41.92 PB21.2 147.38,34.59 149,30.8
GND  (via drill 0.3)
  Bottom 0.2: IC36.35 30.73,118.72 30.92,118.9 31.23,118.9 IC36.36 | IC36.26 27.73,116.69 IC36.PGND IC36.5 | IC36.PGND 29.23,114.69 IC36.22
  other vias: 9,106 30.3,106.3 49.4,110.6 68.5,112.9 87.6,110.6 106.5,108.5 125.6,99.2 9,87 30.3,87.2 49.6,91.7 68.4,94.2 87.6,91.6 106.6,89.6 125.6,74.9 8.9,68 30.3,68.1 49.5,72.7 68.4,75 87.5,72.6 106.6,70.6 9,49 30.5,49.1 49.5,53.7 11.4,30.1 30.4,30 49.5,34.7 68.5,37 87.7,53.6 106.5,51.7 93.7,32.3 117.1,26.2 133.8,16.6 145.8,37.4 129.4,47.1 29.23,115.19 23.75,112.64 14.54,116.06 20.48,115.45 16.05,120.33 25.27,119.27 33.09,119.69 35.02,116.19 137.3,96.1 154.3,29 68.5,56
  pour Top (isolate 0.305): 0,41 5,36 5,23 6,22 43,22 47,26 62,26 64.5,28.5 74.5,28.5 97,23 137,0 139,0 161,39 161,41 138.5,54.3 138.5,120.5 133.5,125.5 5,125.5 0,120.5
  pour Bottom (isolate 0.305): 0,41 5,36 5,23 6,22 43,22 47,26 62,26 64.5,28.5 74.5,28.5 97,23 137,0 139,0 161,39 161,41 138.5,54.3 138.5,120.5 133.5,125.5 5,125.5 0,120.5
I2C_SCL
  Bottom 0.2: 33.5,121.6 118.67,121.6 X2.2
  Bottom 0.203: IC36.33 29.73,119.14 32.2,121.6 33.5,121.6 R2.2
I2C_SDA
  Bottom 0.2: X2.3 119.36,117.44 115.7,121.1 47.76,121.1
  Bottom 0.203: IC36.34 30.23,118.94 32.4,121.1 35,121.1 | 47.76,121.1 35,121.1 | R3.2 35,121.1
N$1
  Top 0.203: IC2.DIN 30.43,113.53 28.68,111.78 IC1.DOUT
N$2
  Top 0.203: IC3.DIN 46.99,117.99 40.78,111.78 IC2.DOUT
N$3
  Top 0.203: IC4.DIN 63.07,120.47 58.84,116.24 IC3.DOUT
N$4
  Top 0.203: IC5.DIN 88.21,117.99 87.48,118.72 IC4.DOUT
N$5
  Top 0.203: IC5.DOUT 92.33,116.14 108.04,116.14 IC6.DIN
N$6
  Top 0.203: IC8.DIN 134.48,80.68 136.5,82.7 136.5,101.6 133.26,104.84 IC7.DOUT
N$7
  Bottom 0.203: VD1.C 5.78,102.52 PB1.1
N$8
  Top 0.203: IC21.DOUT 136.5,49.13 140.77,49.13 146.12,43.78 149.4,43.78 IC22.DIN
N$9
  Top 0.203: IC23.DIN 115.44,57.16 122.9,49.7 122.9,44.1 127.5,39.5 134.6,39.5 144.6,29.5 152.9,29.5 155.4,32 155.4,38.18 IC22.DOUT
N$10
  Top 0.203: IC24.DIN 92.42,59.04 108.16,59.04 108.28,58.92 IC23.DOUT
N$11
  Top 0.203: IC25.DIN 75.88,61.62 76.61,60.89 IC24.DOUT
N$12
  Top 0.203: IC26.DIN 59.84,59.14 64.07,63.37 IC25.DOUT
N$13
  Top 0.203: IC9.DIN 114.64,95.26 118.2,91.7 118.2,87 122.77,82.43 IC8.DOUT
N$14
  Top 0.203: IC14.DIN 27.58,92.78 29.33,94.53 IC13.DOUT
N$15
  Top 0.203: IC27.DIN 39.48,54.68 45.69,60.89 IC26.DOUT
N$16
  Top 0.203: IC21.DIN 119.5,67.39 119.5,73.4 116.74,76.16 IC20.DOUT
N$17
  Bottom 0.203: VD4.C 65.34,109.46 PB4.1
N$18
  Bottom 0.203: VD3.C 46.27,103.28 PB3.1
N$19
  Bottom 0.203: VD5.C 84.39,106.98 PB5.1
N$20
  Bottom 0.203: VD6.C PB6.1
N$21
  Bottom 0.203: VD2.C 27.25,102.52 PB2.1
N$22
  Bottom 0.203: VD13.C PB7.1
N$23
  Bottom 0.203: IC36.2 33.59,116.69 34.35,117.45 35.48,117.45 QZ1.3 36.18,119.57 C20.1
N$24
  Bottom 0.203: VD7.C PB8.1
N$25
  Bottom 0.203: VD8.C PB9.1
N$26
  Bottom 0.203: VD9.C PB10.1
N$27
  Bottom 0.203: VD10.C PB11.1
N$28
  Bottom 0.203: VD11.C PB12.1
N$29
  Bottom 0.203: VD12.C PB13.1
N$30
  Bottom 0.2: VD20.C 120.34,75.96 122.46,73.84 122.46,71.38
  Bottom 0.203: 122.46,71.38 PB14.1
N$31
  Bottom 0.203: IC36.3 33.79,116.19 34.6,117 37.83,117 QZ1.1 C21.1
N$32
  Top 0.203: IC10.DIN 92.76,97.24 92.99,97.01 IC9.DOUT
N$33
  Top 0.203: IC11.DIN 73.68,99.72 74.41,98.99 IC10.DOUT
N$34
  Top 0.203: IC12.DIN 59.94,97.24 64.17,101.47 IC11.DOUT
N$35
  Bottom 0.2: IC36.4 34.11,115.69 35.2,114.6 R4.1
N$36
  Top 0.203: IC13.DIN 41.38,92.78 47.59,98.99 IC12.DOUT
N$37
  Top 0.203: IC6.DOUT 113.96,114.26 116.5,116.8 124.3,116.8 127.22,113.88 IC7.DIN
N$38
  Top 0.203: IC15.DIN 6.87,75.43 3.6,78.7 3.6,90.9 7.23,94.53 IC14.DOUT
N$39
  Top 0.203: IC16.DIN 29.63,75.43 27.88,73.68 IC15.DOUT
N$40
  Top 0.203: IC17.DIN 46.39,79.89 40.18,73.68 IC16.DOUT
N$41
  Top 0.203: IC18.DIN 63.97,82.37 59.74,78.14 IC17.DOUT
N$42
  Top 0.203: IC18.DOUT 84.98,80.62 85.71,79.89 IC19.DIN
N$44
  Top 0.203: IC20.DIN 107.89,77.91 107.66,78.14 IC19.DOUT
N$46
  Bottom 0.203: VD14.C 5.81,64.42 PB15.1
N$47
  Bottom 0.203: VD15.C PB16.1
N$48
  Bottom 0.203: VD16.C PB17.1
N$49
  Bottom 0.203: PB18.1 VD17.C
N$50
  Bottom 0.203: PB19.1 84.37,65.49 VD18.C
N$51
  Bottom 0.203: VD19.C PB20.1 | PB20.1
N$52
  Top 0.203: IC28.DIN 27.78,54.68 29.53,56.43 IC27.DOUT
N$53
  Top 0.203: IC30.DIN 29.53,37.33 27.78,35.58 IC29.DOUT
N$54
  Bottom 0.203: VD21.C PB22.1
N$55
  Bottom 0.203: PB23.1 27.22,42.03 VD22.C
N$56
  Bottom 0.203: VD29.C 7.77,23.64 7.77,25.92 PB29.1
N$57
  Bottom 0.203: VD30.C 25.54,26.32 PB30.1
N$58
  Bottom 0.203: PB24.1 VD23.C
N$59
  Bottom 0.203: PB25.1 65.32,49.17 VD24.C
N$60
  Bottom 0.203: PB26.1 84.37,46.32 VD25.C
N$61
  Bottom 0.203: PB27.1 103.42,44.53 VD26.C
N$62
  Bottom 0.203: VD27.C 125.18,46.02 124.72,45.56 PB21.1
N$63
  Bottom 0.203: VD28.C 139.42,34.08 PB28.1
N$64
  Bottom 0.203: VD31.C 45.69,30.2 PB31.1
N$65
  Bottom 0.2: VD32.C 65.37,33.26 PB32.1
N$66
  Bottom 0.203: PB33.1 89.29,29.75 86.04,29.75 VD33.C
N$67
  Bottom 0.203: VD34.C 110.86,22.23 112.53,23.89 PB34.1
N$68
  Bottom 0.203: PB35.1 129.16,14.74 127.27,12.84 VD35.C
N$69
  Top 0.203: IC31.DIN 47.19,41.79 40.98,35.58 IC30.DOUT
N$70
  Top 0.203: IC32.DIN 63.57,44.27 59.34,40.04 IC31.DOUT
N$71
  Top 0.203: IC32.DOUT 90.18,42.52 93.78,38.92 96.96,38.92 IC33.DIN
N$72
  Top 0.203: IC33.DOUT 100.44,36.1 115.4,36.1 119.1,32.4 120.86,32.4 IC34.DIN
N$74
  Top 0.203: IC35.DIN 135.54,24.2 133.6,24.2 130,27.8 125.17,27.8 IC34.DOUT
N$75
  Top 0.203: IC29.DIN 10.77,37.33 4.2,43.9 4.2,53.6 7.03,56.43 IC28.DOUT
ROW0
  Bottom 0.2: IC36.15 28.73,111.14 27.7,110.1 7,110.1 3,106.1
  Bottom 0.203: 49.6,101.5 38.4,101.5 34.1,97.2 30.6,97.2 | 49.6,101.5 54.8,101.5 57.2,103.9 68.7,103.9 | 68.7,103.9 80.9,103.9 83.6,101.2 87.7,101.2 | 87.7,101.2 100.5,101.2 102.8,98.9 106.7,98.9 | 9.1,97.2 4.2,97.2 3,98.4 3,106.1 | 9.1,97.2 30.6,97.2 | VD6.A 106.7,98.91 106.7,98.9 | VD5.A 87.69,101.21 87.7,101.2 | VD4.A 68.63,103.97 68.7,103.9 | VD3.A 49.58,101.52 49.6,101.5 | VD2.A 30.55,97.25 30.6,97.2 | VD1.A 9.1,98.65 9.1,97.2 | VD13.A 119.2,92.06 119.2,97.8 118.1,98.9 106.7,98.9
ROW1
  Bottom 0.2: IC36.16 28.23,111.33 27.5,110.6 6.8,110.6 2.5,106.3
  Bottom 0.203: 9.1,77.5 4.2,77.5 2.5,79.2 2.5,106.3 | 9.1,77.5 30.51,77.5 | 30.51,77.5 33.7,77.5 38.3,82.1 49.6,82.1 | 49.6,82.1 51.2,82.1 53.8,84.7 68.61,84.7 | 68.61,84.7 80.7,84.7 82.9,82.5 87.67,82.5 | 87.67,82.5 89.8,82.5 91.9,80.4 106.72,80.4 | 106.72,80.4 120.27,80.4 VD20.A | VD12.A 106.72,80.4 | VD11.A 87.67,82.5 | VD10.A 68.61,84.7 | VD9.A 49.6,84.1 49.6,82.1 | VD8.A 30.51,77.5 | VD7.A 9.1,77.5
ROW2
  Bottom 0.2: IC36.17 27.73,111.53 27.3,111.1 6.6,111.1 2,106.5
  Bottom 0.203: 9.1,58.4 4.4,58.4 2,60.8 2,106.5 | 9.1,58.4 30.6,58.4 | 30.6,58.4 33,58.4 38.4,63.8 49.6,63.8 | 49.6,63.8 50.6,63.8 52.9,66.1 68.62,66.1 | 68.62,66.1 80.4,66.1 82.6,63.9 87.7,63.9 87.76,63.9 | 87.76,63.9 99.9,63.9 102,61.8 106.8,61.8 | VD15.A 30.51,58.49 30.6,58.4 | VD16.A 49.6,65.27 49.6,63.8 | VD18.A 87.76,63.9 | VD19.A 106.8,63.16 106.8,61.8 | VD14.A | VD14.A 9.1,58.4 | VD17.A 68.62,66.1 | 106.8,61.8 121.4,61.8 125.18,58.02 VD27.A
ROW3  (via drill 0.3)
  Top 0.2: v4,110.6 3.8,110.8 3.8,116.5 10.2,122.9 28,122.9 29.3,121.6 v29.3,120.7
  Bottom 0.2: 11.01,40.3 9.1,40.3 | 9.1,40.3 4.35,40.3 1.5,43.15 1.5,106.7 4,109.2 v4,110.6 | VD21.A 9.1,40.3 | IC36.30 28.23,119.03 29.3,120.1 v29.3,120.7
  Bottom 0.203: 11.01,40.3 12.68,40.3 30.5,40.3 | 30.5,40.3 33.8,40.3 38.3,44.8 49.5,44.8 | 87.7,44.4 83.83,44.4 80.53,47.7 68.6,47.7 | 87.7,44.4 95.6,44.4 98.1,41.9 100.1,41.9 100.18,41.9 | 100.18,41.9 113.1,41.9 117,38 128.9,38 132.82,34.08 VD28.A | 49.5,44.8 52.4,44.8 55.3,47.7 68.6,47.7 | VD26.A 100.18,41.9 | VD25.A 87.7,46.27 87.7,44.4 | VD24.A 68.6,49.13 68.6,47.7 | VD23.A 49.55,44.85 49.5,44.8 | VD22.A 30.54,40.34 30.5,40.3
ROW4  (via drill 0.3)
  Top 0.2: v3.3,109.8 3.3,116.7 10,123.4 28.3,123.4 v30,121.7
  Bottom 0.2: 35.03,23.13 42.03,23.13 45.9,27 49,27 | 49,27 49.6,27 53.1,27 55.6,29.5 62.1,29.5 | 62.1,29.5 79.8,29.5 81.4,27.9 82.6,27.9 | VD34.A 103.14,25.5 91.2,25.5 88.8,27.9 83.4,27.9 82.6,27.9 | VD31.A 49,28.06 49,27 | VD32.A 62.1,30.74 62.1,29.5 | 15.2,23.13 14.7,23.63 | VD33.A 82.64,27.9 82.6,27.9 | IC36.31 28.73,118.83 30,120.1 v30,121.7 | v3.3,109.8 3.3,109.2 1,106.9 1,43
  Bottom 0.203: VD34.A 108.94,19.7 114.31,19.7 121.17,12.84 VD35.A | 15.2,23.13 20.8,23.13 21.28,23.13 | 21.28,23.13 35.03,23.13 | VD30.A 21.28,23.13 | 1,43 6.4,37.6 6.4,30.6 7.8,29.2 12.6,29.2 14.7,27.1 14.7,23.63 VD29.A
SWD_CLK
  Bottom 0.2: IC36.28 27.23,119.39 TP1.TP
SWD_IO
  Bottom 0.2: IC36.25 25.26,116.19 TP2.TP
USB_DM
  Bottom 0.203: IC36.23 24.01,115.19 23.31,115.89 X1.D-
USB_DP
  Bottom 0.203: IC36.24 24.31,115.69 23.95,116.05 R1.1 23.96,119.11 X1.D+
VCC  (via drill 0.3)
  Top 0.2: v35,124.17 35,124 34.1,123.1 v34.1,118.35 | v38.7,114.6 38.31,114.99 v33.6,114.99
  Top 0.406: v16.07,118.63 17.98,120.55 21.05,120.55 23.8,117.8 | v24.9,117.8 23.8,117.8 | v34.1,118.35 33.6,117.85 v33.6,114.99 30.19,114.99 28.2,113 v25,113 23.8,114.2 23.8,117.2 23.8,117.8
  Bottom 0.2: IC36.6 33.3,114.69 v33.6,114.99 35.19,113.4 C22.1 | R4.2 v38.7,114.6
  Bottom 0.203: IC36.1 33.39,117.19 34.1,117.9 v34.1,118.35 | IC36.19 25.19,113.19 v25,113 | IC36.27 25.51,117.19 v24.9,117.8 | R3.1 35,123.1 | 35,123.1 v35,124.17 | R2.1 34.95,123.05 35,123.1
  Bottom 0.406: C2.+ 17.43,120.33 16.07,118.97 v16.07,118.63 IC37.2 IC37.4

### Text on the board
bPlace: github.com/netcatu | redox-light | v1.0.0